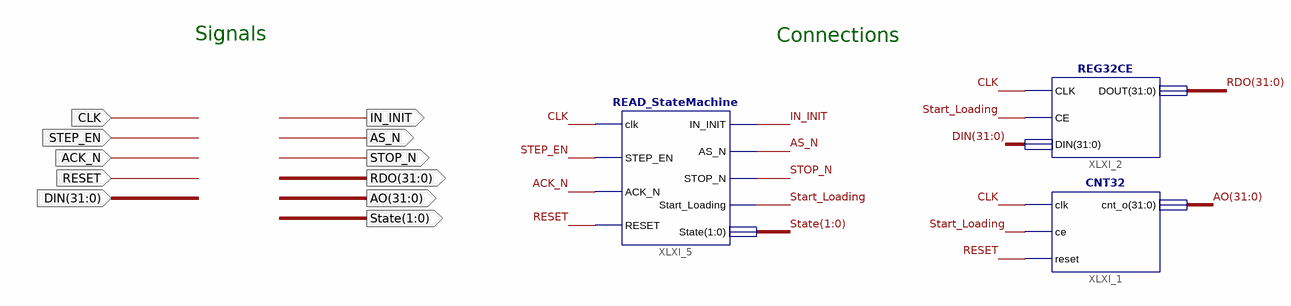
[diagram p0: schematic sheet 1]
// Xilinx ISE schematic READM.sch (spartan6) as structural Verilog: 3 symbols, 11 ports
module READM (
  input  RESET,
  input  [31:0] DIN,
  input  CLK,
  input  ACK_N,
  input  STEP_EN,
  output [31:0] RDO,
  output [31:0] AO,
  output [1:0] State,
  output STOP_N,
  output AS_N,
  output IN_INIT
);

  wire Start_Loading;

  READ_StateMachine XLXI_5 (
    .clk(CLK), .STEP_EN(STEP_EN), .ACK_N(ACK_N), .RESET(RESET), .IN_INIT(IN_INIT), .AS_N(AS_N),
    .STOP_N(STOP_N), .Start_Loading(Start_Loading), .State(State));
  REG32CE XLXI_2 (.CLK(CLK), .CE(Start_Loading), .DIN(DIN), .DOUT(RDO));
  CNT32 XLXI_1 (.clk(CLK), .ce(Start_Loading), .reset(RESET), .cnt_o(AO));

  // Notes on the sheet:
  //   Signals
  //   Connections
endmodule
